# EAGLE design dennisquad (EAGLE 6.5.0)
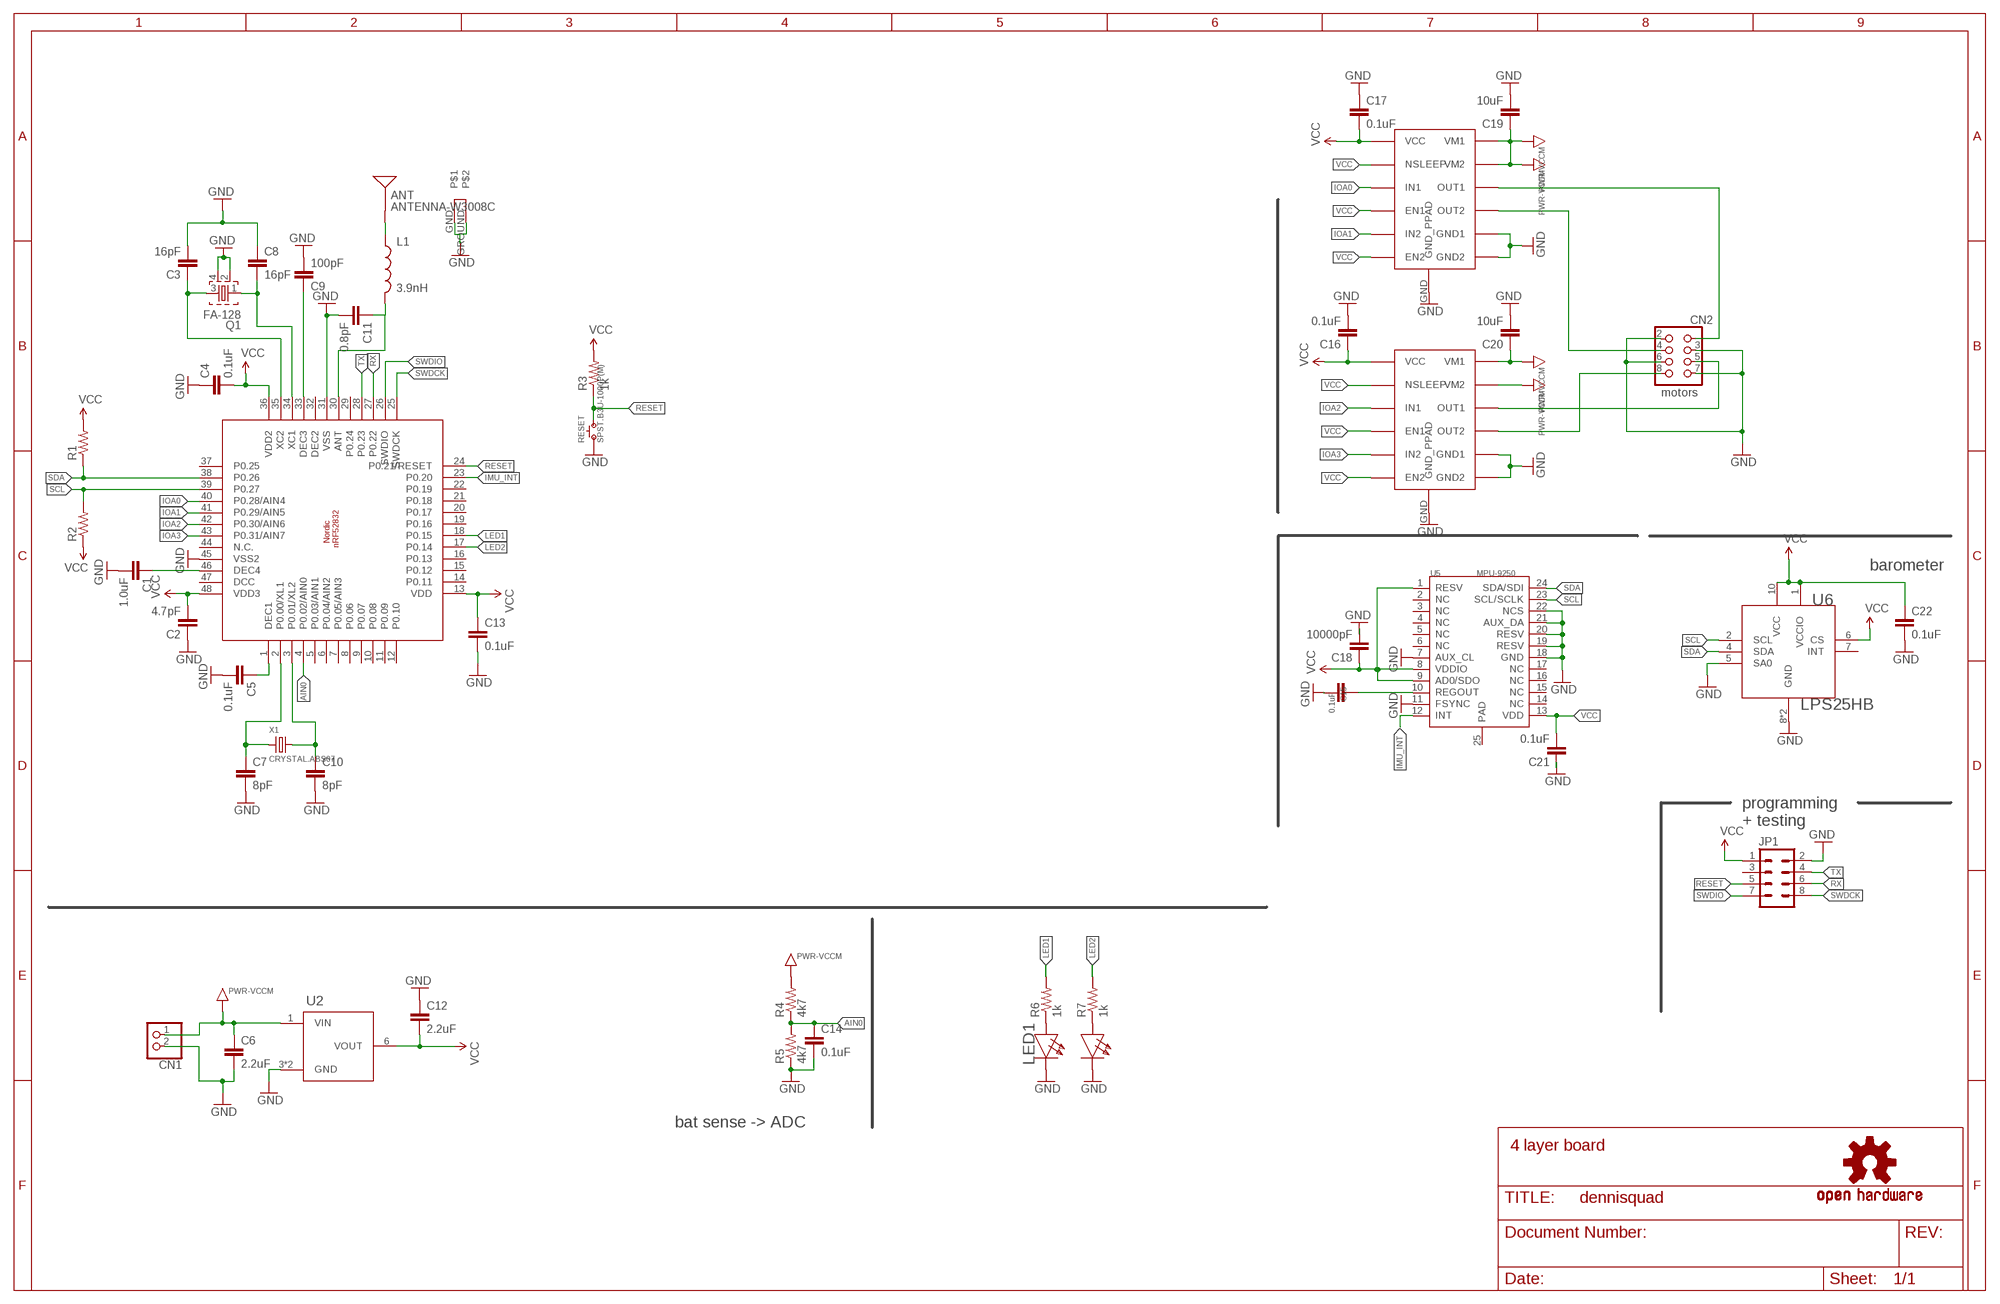
[diagram p0: schematic, sheet 1]

## Parts
ANT  ANTENNA-W3008C  [ANTENNA-W3008C]
C1  1.0uF  CAP0603-CAP  [0603-CAP]
C2  4.7pF  CAP0603-CAP  [0603-CAP]
C3  16pF  CAP0402-CAP  [0402-CAP]
C4  0.1uF  CAP0402-CAP  [0402-CAP]
C5  0.1uF  CAP0402-CAP  [0402-CAP]
C6  2.2uF  CAP0402-CAP  [0402-CAP]
C7  8pF  CAP0402-CAP  [0402-CAP]
C8  16pF  CAP0402-CAP  [0402-CAP]
C9  100pF  CAP0402-CAP  [0402-CAP]
C10  8pF  CAP0402-CAP  [0402-CAP]
C11  0.8pF  CAP0402-CAP  [0402-CAP]
C12  2.2uF  CAP0402-CAP  [0402-CAP]
C13  0.1uF  CAP0402-CAP  [0402-CAP]
C14  0.1uF  CAP0402-CAP  [0402-CAP]
C15  0.1uF  CAP0402-CAP  [0402-CAP]
C16  0.1uF  CAP0402-CAP  [0402-CAP]
C17  0.1uF  CAP0402-CAP  [0402-CAP]
C18  10000pF  CAP0402-CAP  [0402-CAP]
C19  10uF  CAP0603-CAP  [0603-CAP]
C20  10uF  CAP0603-CAP  [0603-CAP]
C21  0.1uF  CAP0402-CAP  [0402-CAP]
C22  0.1uF  CAP0402-CAP  [0402-CAP]
CN1  JST_2PIN-THM  [JST-PH-2-THM]
CN2  HEADER-2X4  [HEADER-2X04-THM]
JP1  M04X2  [2X4]
L1  3.9nH  INDUCTOR0603  [0603]
LED1  LED-DUAL0805  [SMD0805-DUAL]
LOGO1  OSHW-LOGOM  [OSHW-LOGO-M]
Q1  FA-128  [FA-128]
R1  RESISTOR0402  [0402-RES]
R2  RESISTOR0402  [0402-RES]
R3  1k  RESISTOR0402  [0402-RES]
R4  4k7  RESISTOR0402  [0402-RES]
R5  4k7  RESISTOR0402  [0402-RES]
R6  1k  RESISTOR0402  [0402-RES]
R7  1k  RESISTOR0402  [0402-RES]
RESET  SPST.B3U-1000P(M)  [B3U-1000P(M)]
U1  NRF52832_QFN48  [QFN48]
U2  MCP1700T-3302E/MAY  [6-VDFN]
U3  DRV8839  [PWSON-N12]
U4  DRV8839  [PWSON-N12]
U5  MPU-9250  [LEAD-QFN24]
U6  LPS25HB  [HLGA10L]
X1  CRYSTAL.ABS07  [ABS07]

## Nets
AIN0: C14.1 R4.1 R5.2 U1.4(P0.02/AIN0)
GND [gnd]: ANT.GND ANT.GROUND C1.2 C2.1 C3.2 C4.1 C5.2 C6.2 C7.2 C8.1 C9.2 C10.2 C11.2 C12.1 C13.2 C14.2 C15.2 C16.2 C17.1 C18.2 C19.2 C20.2 C21.1 C22.2 CN1.2 CN2.2 CN2.3 CN2.6 CN2.7 JP1.2 LED1.2(CB) LED1.3(CR) Q1.2 Q1.4 R5.1 RESET.1 U1.31(VSS) U1.45(VSS2) U2.3(GND) U2.P$1(GND) U3.GND(GND_PPAD) U3.P$5(GND1) U3.P$6(GND2) U4.GND(GND_PPAD) U4.P$5(GND1) U4.P$6(GND2) U5.7(AUX_CL) U5.11(FSYNC) U5.18(GND) U5.19(RESV) U5.20(RESV) U5.21(AUX_DA) U5.22(NCS) U6.5(SA0) U6.8(GND) U6.9(GND)
IMU_INT: U1.23(P0.20) U5.12(INT)
IOA0: U1.40(P0.28/AIN4) U3.P$9(IN1)
IOA1: U1.41(P0.29/AIN5) U3.P$11(IN2)
IOA2: U1.42(P0.30/AIN6) U4.P$9(IN1)
IOA3: U1.43(P0.31/AIN7) U4.P$11(IN2)
LED1: R6.2 U1.18(P0.15)
LED2: R7.2 U1.17(P0.14)
N$12: C15.1 U5.10(REGOUT)
N$13: C7.1 U1.2(P0.00/XL1) X1.1
N$14: LED1.1(AB) R6.1
N$15: LED1.4(AR) R7.1
N$16: CN2.1 U3.P$3(OUT1)
N$17: CN2.4 U3.P$4(OUT2)
N$18: ANT.FEED(SIGNAL) L1.1
N$19: CN2.5 U4.P$3(OUT1)
N$20: CN2.8 U4.P$4(OUT2)
N$21: C10.1 U1.3(P0.01/XL2) X1.2
N$22: C1.1 U1.46(DEC4)
N$26: C5.1 U1.1(DEC1)
N$28: C9.1 U1.33(DEC3)
N$30: C8.2 Q1.1 U1.34(XC1)
N$31: C3.1 Q1.3 U1.35(XC2)
N$32: C11.1 L1.2 U1.30(ANT)
RESET: JP1.5 R3.1 RESET.2 U1.24(P0.21/RESET)
RX: JP1.6 U1.27(P0.22)
SCL: R2.2 U1.39(P0.27) U5.23(SCL/SCLK) U6.2(SCL)
SDA: R1.1 U1.38(P0.26) U5.24(SDA/SDI) U6.4(SDA)
SWDCK: JP1.8 U1.25(SWDCK)
SWDIO: JP1.7 U1.26(SWDIO)
TX: JP1.4 U1.28(P0.23)
VCC: C2.2 C4.2 C12.2 C13.1 C16.1 C17.2 C18.1 C21.2 C22.1 JP1.1 R1.2 R2.1 R3.2 U1.13(VDD) U1.36(VDD2) U1.48(VDD3) U2.6(VOUT) U3.P$7(VCC) U3.P$8(NSLEEP) U3.P$10(EN1) U3.P$12(EN2) U4.P$7(VCC) U4.P$8(NSLEEP) U4.P$10(EN1) U4.P$12(EN2) U5.1(RESV) U5.8(VDDIO) U5.9(AD0/SDO) U5.13(VDD) U6.1(VCCIO) U6.6(CS) U6.10(VCC)
VCCM: C6.1 C19.1 C20.1 CN1.1 R4.2 U2.1(VIN) U3.P$1(VM1) U3.P$2(VM2) U4.P$1(VM1) U4.P$2(VM2) ; supply symbol labelled PWR-VCCM
Unconnected: JP1.3 U1.5(P0.03/AIN1) U1.6(P0.04/AIN2) U1.7(P0.05/AIN3) U1.8(P0.06) U1.9(P0.07) U1.10(P0.08) U1.11(P0.09) U1.12(P0.10) U1.14(P0.11) U1.15(P0.12) U1.16(P0.13) U1.19(P0.16) U1.20(P0.17) U1.21(P0.18) U1.22(P0.19) U1.29(P0.24) U1.37(P0.25) U1.44(N.C.) U5.2(NC) U5.3(NC) U5.4(NC) U5.5(NC) U5.6(NC) U5.14(NC) U5.15(NC) U5.16(NC) U5.17(NC) U5.25(PAD) U6.7(INT)

## Notes on the sheet
- motors
- barometer
- programming
  + testing
- bat sense -> ADC
- 4 layer board

## Power pins joined to a net without a drawn wire
DCC: U1.47(DCC)
DEC2: U1.32(DEC2)

## Library data of the parts
ANT = SparkFun-RF:ANTENNA-W3008C
C1 C2 = SparkFun-Capacitors:CAP: Capacitor Standard 0603 ceramic capacitor, and 0.1" leaded capacitor.
C3 C8 = SparkFun-Capacitors:CAP: Capacitor Standard 0603 ceramic capacitor, and 0.1" leaded capacitor.; MPN: GRM1555C1H160GA01D
C4 C5 C13-C17 C21 C22 = SparkFun-Capacitors:CAP: Capacitor Standard 0603 ceramic capacitor, and 0.1" leaded capacitor.; MPN: CL05B104JO5NNNC
C6 C12 = SparkFun-Capacitors:CAP: Capacitor Standard 0603 ceramic capacitor, and 0.1" leaded capacitor.; MPN: GRT155R61C225KE13D
C7 C10 = SparkFun-Capacitors:CAP: Capacitor Standard 0603 ceramic capacitor, and 0.1" leaded capacitor.; MPN: GRM1555C1H8R0BA01D
C9 = SparkFun-Capacitors:CAP: Capacitor Standard 0603 ceramic capacitor, and 0.1" leaded capacitor.; MPN: GRM1555C1H101JA01D
C11 = SparkFun-Capacitors:CAP: Capacitor Standard 0603 ceramic capacitor, and 0.1" leaded capacitor.; MPN: GRM1555C2AR80BA01D
C18 = SparkFun-Capacitors:CAP: Capacitor Standard 0603 ceramic capacitor, and 0.1" leaded capacitor.; MPN: CL05B103KP5NNNC
C19 C20 = SparkFun-Capacitors:CAP: Capacitor Standard 0603 ceramic capacitor, and 0.1" leaded capacitor.; MPN: C1206C106M4RACAUTO
CN1 = adafruit:JST_2PIN: JST 2-Pin Connectors of various flavors SMT-RA (S2B-PH-SM4) 4UConnector #17311 SMT (B2B-PH-SM4) THM-RA (S2B-PH) THM (B2B-PH)
CN2 = jaw:HEADER-2X4: PIN HEADER
JP1 = SparkFun-Connectors:M04X2: .1" header, two rows of four.
L1 = SparkFun-Passives:INDUCTOR: Inductors Basic Inductor/Choke - 0603 and 1206. Footprints are not proven and vary greatly between part numbers. INDUCTOR POWER 3.3UH 4.0A SMD 0.197" L x 0.197" W x 0.177" H (5.00mm x 5.00mm x 4.50mm); MPN: AISC-0402-3N9J-T
LED1 = jaw:LED-DUAL; MPN: APHBM2012QBDSURKC
LOGO1 = SparkFun-Aesthetics:OSHW-LOGO: Open Source Hardware Logo This logo indicates the piece of hardware it is found on incorporates a OSHW license and/or adheres to the definition of open source hardware found here: http://freedomdefined.org/OSHW
Q1 = crystal:FA-: MHz RANGE CRYSTAL UNIT Source: Epson Toyocom; MPN: FA-128 32.0000MF20X-K3
R1 R2 = SparkFun-Resistors:RESISTOR: Resistor Basic schematic elements and footprints for 0603, 1206, and PTH resistors.
R3 R6 R7 = SparkFun-Resistors:RESISTOR: Resistor Basic schematic elements and footprints for 0603, 1206, and PTH resistors.; MPN: ERJ-2GEJ102X
R4 R5 = SparkFun-Resistors:RESISTOR: Resistor Basic schematic elements and footprints for 0603, 1206, and PTH resistors.; MPN: ERJ-PA2F4701X
RESET = omron:SPST
U1 = nRF52Series:NRF52832_QFN48: Footprint and schematic part for Nordic nRF52832 of the QFN 48 pin variant. Created 6/23/15 by Jacob Dixon; FOOTPRINT: QFN48
U2 = wrea:MCP1700T-3302E/MAY; MPN: MCP1700T-3302E/MAY
U3 U4 = jseng:DRV8839
U5 = template:MPU-9250
U6 = jaw:LPS25HB
X1 = abracon:CRYSTAL; MPN: ABS07-120-32.768KHZ-T

## Net classes
2 gnd: width 0.152 mm, drill 0.254 mm, clearance 0.152 mm
5 3.3v: width 0.152 mm, drill 0.406 mm, clearance 0.152 mm

## Board
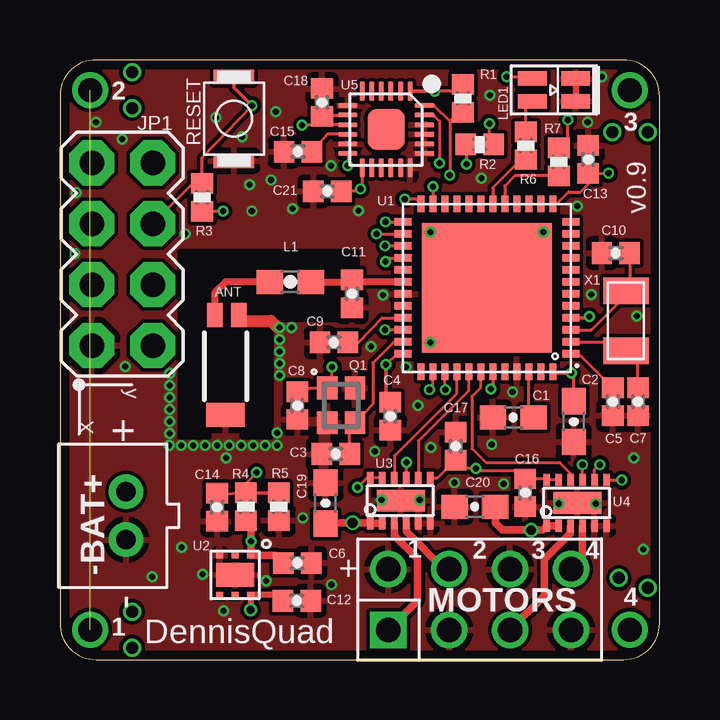
[diagram p1: board, top side]
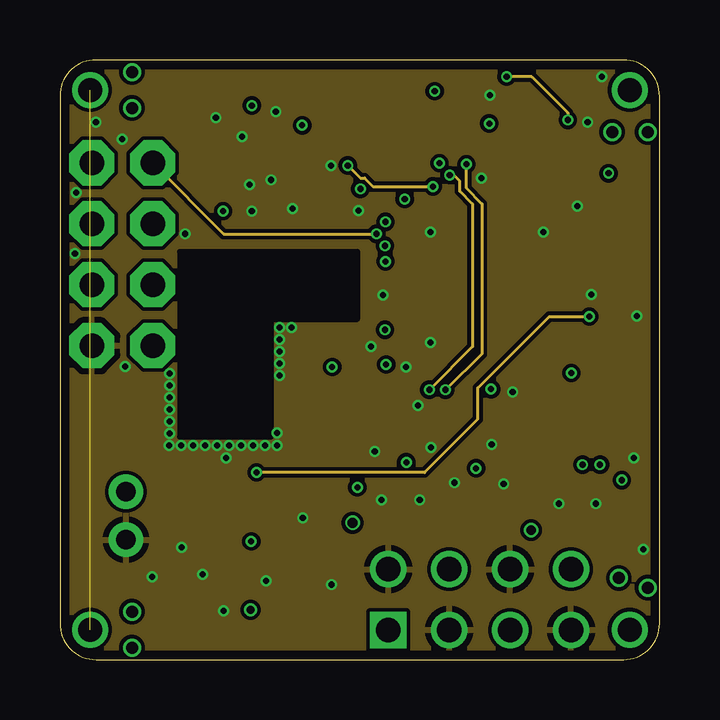
[diagram p2: board, inner layer GND]
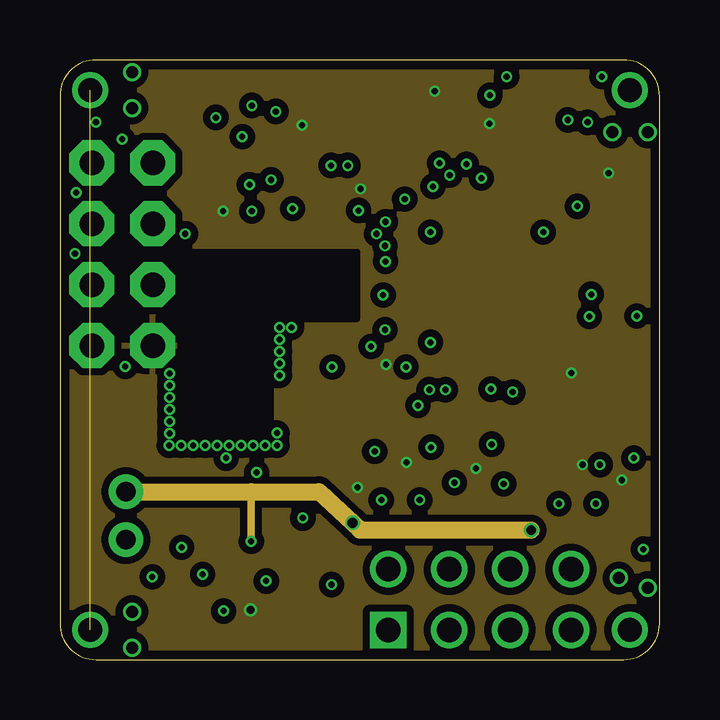
[diagram p3: board, inner layer VCC]
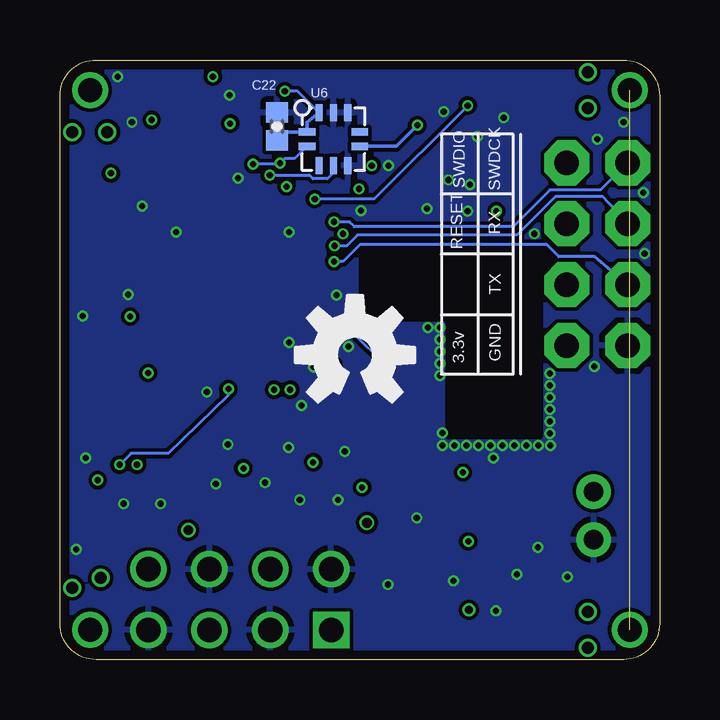
[diagram p4: board, bottom side, seen from below]

Size 25 x 25 mm. Coordinates in mm from the lower left corner, seen from the top.
Outline: 25,1.5 25,23.5 arc90 23.5,25 1.5,25 arc90 0,23.5 0,1.5 arc90 1.5,0 23.5,0 arc90 25,1.5
Copper layers (1*2*15*16): Top 0.035559375mm / dielectric 0.17018125mm / GND 0.01778125mm / dielectric 47mil / VCC 0.01778125mm / dielectric 0.17018125mm / Bottom 0.035559375mm
Design rules "OSHPark-4layer": minimum track width 5mil, minimum drill 10mil, track to track 5mil, track to pad 5mil, pad to pad 5mil, via to via 5mil, smd to smd 5mil, copper to edge 15mil, drill to drill 6mil, minimum pad ring 4mil, minimum via ring 4mil, stop-mask expansion 4mil, vias tented up to drill 0mil, thermal gap 10mil

### Footprints (pad centres in the part's own frame; a part is rotated, then mirrored left to right if it is on the bottom)
ANTENNA-W3008C = smd 0.65 x 1: FEED -0.45,2.52; GROUND 0.55,2.52 | smd 1.6 x 1: GND 0,-1.651
0603-CAP = smd 1.1 x 1: 1 -0.85,0; 2 0.85,0
0402-CAP = smd 0.85 x 0.9: 1 -0.58,0; 2 0.58,0
JST-PH-2-THM = drill 0.8 pad 1.422: 1 1,0; 2 -1,0
HEADER-2X04-THM = drill 1.016 square: 1 -3.81,-1.27 | drill 1.016: 2 -3.81,1.27; 3 -1.27,-1.27; 4 -1.27,1.27; 5 1.27,-1.27; 6 1.27,1.27; 7 3.81,-1.27; 8 3.81,1.27
2X4 = drill 1.016 pad 1.88 octagon: 1 -3.81,-1.27; 2 -3.81,1.27; 3 -1.27,-1.27; 4 -1.27,1.27; 5 1.27,-1.27; 6 1.27,1.27; 7 3.81,-1.27; 8 3.81,1.27
0603 = smd 1.1 x 1: 1 -0.85,0; 2 0.85,0
SMD0805-DUAL = smd 1.2 x 0.6: 1 -0.9,-0.475; 2 0.9,-0.475; 3 0.9,0.475; 4 -0.9,0.475
FA-128 = smd 0.95 x 0.85: 1 -0.725,-0.575; 2 0.725,-0.575; 3 0.725,0.575; 4 -0.725,0.575
0402-RES = smd 0.85 x 0.9: 1 -0.58,0; 2 0.58,0
B3U-1000P(M) = smd 0.6 x 1.7: 1 -1.75,0; 2 1.75,0
QFN48 = smd 0.3 x 0.7: 1 -2.75,-3.5; 2 -2.25,-3.5; 3 -1.75,-3.5; 4 -1.25,-3.5; 5 -0.75,-3.5; 6 -0.25,-3.5; 7 0.25,-3.5; 8 0.75,-3.5; 9 1.25,-3.5; 10 1.75,-3.5; 11 2.25,-3.5; 12 2.75,-3.5; 25 2.75,3.5; 26 2.25,3.5; 27 1.75,3.5; 28 1.25,3.5; 29 0.75,3.5; 30 0.25,3.5; 31 -0.25,3.5; 32 -0.75,3.5; 33 -1.25,3.5; 34 -1.75,3.5; 35 -2.25,3.5; 36 -2.75,3.5 | smd 0.7 x 0.3: 13 3.5,-2.75; 14 3.5,-2.25; 15 3.5,-1.75; 16 3.5,-1.25; 17 3.5,-0.75; 18 3.5,-0.25; 19 3.5,0.25; 20 3.5,0.75; 21 3.5,1.25; 22 3.5,1.75; 23 3.5,2.25; 24 3.5,2.75; 37 -3.5,2.75; 38 -3.5,2.25; 39 -3.5,1.75; 40 -3.5,1.25; 41 -3.5,0.75; 42 -3.5,0.25; 43 -3.5,-0.25; 44 -3.5,-0.75; 45 -3.5,-1.25; 46 -3.5,-1.75; 47 -3.5,-2.25; 48 -3.5,-2.75 | smd 5.4 x 5.4: 49 0,0
6-VDFN = smd 0.3 x 0.25: 1 -0.65,-0.825; 2 0,-0.825; 3 0.65,-0.825; 4 0.65,0.825; 5 0,0.825; 6 -0.65,0.825 | smd 1.6 x 1: P$1 0,0
PWSON-N12 = smd 2 x 0.9: GND 0.82,0.63 | smd 0.28 x 0.5: P$1 -0.46,-0.32; P$2 0.04,-0.32; P$3 0.54,-0.32; P$4 1.04,-0.32; P$5 1.54,-0.32; P$6 2.04,-0.32; P$7 -0.46,1.58; P$8 0.04,1.58; P$9 0.54,1.58; P$10 1.04,1.58; P$11 1.54,1.58; P$12 2.04,1.58
LEAD-QFN24 = smd 0.8 x 0.2: 1 -1.6,1; 2 -1.6,0.6; 3 -1.6,0.2; 4 -1.6,-0.2; 5 -1.6,-0.6; 6 -1.6,-1; 13 1.6,-1; 14 1.6,-0.6; 15 1.6,-0.2; 16 1.6,0.2; 17 1.6,0.6; 18 1.6,1 | smd 0.2 x 0.8: 7 -1,-1.6; 8 -0.6,-1.6; 9 -0.2,-1.6; 10 0.2,-1.6; 11 0.6,-1.6; 12 1,-1.6; 19 1,1.6; 20 0.6,1.6; 21 0.2,1.6; 22 -0.2,1.6; 23 -0.6,1.6; 24 -1,1.6 | smd 1.7 x 1.54: 25 0,0
HLGA10L = smd 0.7 x 0.3: 1 -1.1,0.3; 2 -1.1,-0.3; 6 1.1,-0.3; 7 1.1,0.3 | smd 0.3 x 0.7: 3 -0.6,-1.1; 4 0,-1.1; 5 0.6,-1.1; 8 0.6,1.1; 9 0,1.1; 10 -0.6,1.1
ABS07 = smd 1.1 x 1.9: 1 -1.25,0; 2 1.25,0

### Placement (x,y rotation side)
ANT  6.9,11.85 0 top
C1  18.9,10.1 180 top
C2  21.43,9.93 90 top
C3  11.5,8.57 180 top
C4  13.78,10.15 90 top
C5  23.05,10.75 270 top
C6  9.9,4.03 0 top
C7  24.1,10.75 270 top
C8  9.9,10.59 90 top
C9  11.43,13.22 180 top
C10  23.18,16.95 180 top
C11  12.18,15.25 270 top
C12  9.88,2.45 180 top
C13  22.02,20.85 90 top
C14  6.55,6.35 270 top
C15  9.93,21.18 180 top
C16  19.4,6.95 270 top
C17  16.5,8.9 270 top
C18  10.93,23.23 90 top
C19  11.07,6.53 90 top
C20  17.3,6.38 180 top
C21  11.15,19.52 0 top
C22  15.95,22.23 90 bottom
CN1  2.75,6 90 top
CN2  17.5,2.5 0 top
JP1  2.6,16.9 90 top
L1  9.6,15.75 0 top
LED1  20.6,23.75 0 top
LOGO1  12.7,12.7 0 bottom
Q1  11.72,10.6 270 top
R1  16.8,23.4 90 top
R2  17.5,21.48 180 top
R3  5.92,19.27 270 top
R4  7.75,6.38 270 top
R5  9.12,6.38 90 top
R6  19.43,21.43 270 top
R7  20.8,20.75 270 top
RESET  7.25,22.55 90 top
U1  17.8,15.5 90 top
U2  7.3,3.52 180 top
U3  13.4,6 0 top
U4  20.75,5.9 0 top
U5  13.6,22.1 270 top
U6  13.6,21.7 0 bottom
X1  23.6,14.12 90 top

### Tracks (layer width: path | path; a pad name or v marks a point on that pad's centre or on a via)
AIN0  (via drill 0.25)
  Top 0.127: C14.1 6.58,6.91 R4.1 7.75,7.35 v8.2,7.8
  Top 0.152: R5.2 R4.1 | U1.4 22.02,14.25 v22.07,14.3
  GND 0.127: v22.07,14.3 20.4,14.3 17.43,11.32 17.43,10.03 15.2,7.8 v8.2,7.8
GND  (via drill 0.25)
  Top 0.127: 9.07,13.85 v9.15,13.85
  Top 0.25: LED1.3 LED1.2
  Top 0.5: ANT.GROUND 7.47,14.12 8.8,14.12 9.07,13.85
  other vias: 3.85,3.45 7.9,19.8 22,22.4 22.15,15.22 18,8.97 9,22.85 7.6,21.8 11.3,20.6 21.57,18.9 6.92,8.4 24.32,4.6 23.93,8.4 14.93,10.6 13.4,6.65 15,6.65 20.8,6.5 22.35,6.5 12.97,13.05 4.58,11.43 4.58,10.93 4.58,10.43 4.58,9.93 4.58,9.43 11.32,3.12 5.08,4.67 12.45,18.73 13.47,15.2 5.05,8.93 5.55,8.93 6.05,8.93 6.55,8.93 7.05,8.93 7.55,8.93 8.05,8.93 8.55,8.93 9.05,8.93 22.6,24.3 17.57,20.07 17.93,23.52 13.12,8.68 15.47,8.85 6.5,22.6 1.5,22.4 2.6,21.7 0.62,16.93 8,18.7 8.8,20 9.7,18.8 18.88,11.15 15.45,17.82 20.15,17.82 15.45,13.22 24.05,14.32 14.43,12.2 16.45,7.38 18.5,7.33 8.6,3.27 6.83,2.02 10.12,5.9 9.15,13.35 9.15,12.85 9.65,13.85 5.22,17.75 0.68,19.48 2.73,12.22 9.05,9.45 4.55,8.93 4.58,11.93 9.15,12.35 9.15,11.85 5.95,3.55
  pour Bottom: 0,0 0,25.5 25.5,25.5 25.5,0
  pour Top: -0.05,0 -0.05,25.5 25.45,25.5 25.45,0
  pour GND (isolate 0.1): -0.05,0 -0.05,25.5 25.45,25.5 25.45,0
  cutout Top: 12.4,17 5,17 5,9.3 6.2,9.3 6.2,10.6 7.6,10.6 7.6,9.3 8.8,9.3 8.8,14.2 12.4,14.2
  cutout Bottom: 12.4,17 5,17 5,9.3 8.8,9.3 8.8,14.2 12.4,14.2
IMU_INT  (via drill 0.25)
  Top 0.127: U5.12 v12,20.6 | v15.55,19.73 U1.23
  GND 0.127: v12,20.6 12.53,20.07 12.7,20.07 13.05,19.73 v15.55,19.73
IOA0
  Top 0.127: U1.40 16.55,11.1 13.94,8.49 U3.P$9
IOA1
  Top 0.127: U1.41 17.05,11.22 14.94,9.12 U3.P$11
IOA2
  Top 0.127: U4.P$9 21.29,7.76 20.85,8.2 17.77,8.2 17.18,8.8 17.18,10.97 17.55,11.35 U1.42
IOA3  (via drill 0.25)
  Top 0.127: U4.P$11 22.29,7.92 v22.52,8.12 | U1.43 18.05,11.35 v17.98,11.28
  Bottom 0.127: v22.52,8.12 22.04,8.6 20.5,8.6 17.98,11.03 v17.98,11.28
LED1
  Top 0.127: U1.18 18.05,19.68 19.23,20.85 R6.2
LED2
  Top 0.127: R7.2 18.97,20.17 18.55,19.75 U1.17
N$1  (via drill 1)  (1 unrouted)
  other vias: 1.25,23.75 1.25,1.25
N$2  (via drill 1)
  other vias: 23.75,1.25
N$3  (via drill 1)
  other vias: 23.75,23.75
N$4  (via drill 0.5)
  other vias: 23.02,22
N$5  (via drill 0.5)
  other vias: 24.5,22
N$6  (via drill 0.5)
  other vias: 3,24.5
N$7  (via drill 0.5)
  other vias: 3,23
N$8  (via drill 0.5)
  other vias: 23.3,3.4
N$9  (via drill 0.5)
  other vias: 24.5,3
N$10  (via drill 0.5)
  other vias: 3,2
N$11  (via drill 0.5)
  other vias: 3,0.5
N$12
  Top 0.127: U5.10 11.15,21.9 C15.1
N$13
  Top 0.127: U1.2 23.02,13.25 X1.1 24.1,12.38 C7.1
N$14
  Top 0.127: R6.1 19.43,23 LED1.1
N$15  (via drill 0.25)
  Top 0.127: v18.62,24.3 19.62,24.3 LED1.4 | R7.1 21.18,21.7 v21.18,22.5
  GND 0.127: v18.62,24.3 19.68,24.3 21.18,22.8 v21.18,22.5
N$16
  Top 0.32: CN2.1 14.9,2.44 14.9,4.22 13.94,5.17 U3.P$3
N$17
  Top 0.32: U3.P$4 14.44,5.33 16,3.77 CN2.4
N$18
  Top 0.286: L1.1 6.9,15.75 6.45,15.3 ANT.FEED
N$19
  Top 0.32: U4.P$3 21.29,5.26 20.2,4.17 20.2,2.66 CN2.5
N$20
  Top 0.32: U4.P$4 21.79,4.26 CN2.8
N$21
  Top 0.127: C10.1 23.75,15.51 X1.2 23.5,15.1 22.15,13.75 U1.3
N$22
  Top 0.127: C1.1 19.55,10.3 U1.46
N$26
  Top 0.127: U1.1 21.63,12.75 C5.1
N$28
  Top 0.127: U1.33 13.43,14.25 12.46,13.22 C9.1
N$30  (via drill 0.25)
  Top 0.127: U1.34 v13.55,13.75 | v11.35,12.2 11.35,11.6 Q1.1 10.23,11.32 C8.2
  Bottom 0.127: v13.55,13.75 12.9,13.75 v11.35,12.2
N$31
  Top 0.127: U1.35 13.93,13.25 13.05,12.38 13.05,10.65 Q1.3 12.08,9.58 C3.1
N$32
  Top 0.286: U1.30 12.26,15.75 C11.1 12.1,15.75 L1.2
RESET  (via drill 0.25)
  Top 0.127: U1.24 14.85,19.2 v14.38,19.2 | v8,23.1 5.92,20.93 R3.1 5.55,19.86 JP1.5
  Top 0.152: RESET.2 7.25,23.85 v8,23.1
  Bottom 0.127: v14.38,19.2 11.9,19.2 v8,23.1
RX  (via drill 0.25)
  Top 0.127: U1.27 v13.55,17.25
  Bottom 0.127: JP1.6 2.36,19.3 4.35,19.3 5.95,17.7 12.6,17.7 13.05,17.25 v13.55,17.25
SCL  (via drill 0.25)
  Top 0.127: U5.23 15.57,22.7 15.82,22.45 v15.82,20.7 | U1.39 16.02,11.3 v16.07,11.25 | R2.2 v16.95,20.65
  GND 0.127: v16.07,11.25 17.6,12.75 17.6,19 16.95,19.65 v16.95,20.65
  Bottom 0.127: U6.2 15.2,20.9 15.62,20.9 v15.82,20.7 15.9,20.65 v16.95,20.65
SDA  (via drill 0.25)
  Top 0.127: U5.24 15.6,23.1 16.25,22.45 | v15.4,11.25 15.55,11.38 U1.38 | 16.25,22.45 v16.25,20.2 | 16.25,22.45 16.62,22.82 R1.1
  GND 0.127: v15.4,11.25 17.2,13.05 17.2,19 16.68,19.52 16.68,19.95 16.43,20.2 v16.25,20.2
  Bottom 0.127: U6.4 13.6,20.3 13.85,20.05 14.45,20.05 14.6,20.2 v16.25,20.2
SWDCK  (via drill 0.25)
  Top 0.127: v13.57,18.25 U1.25
  Bottom 0.127: JP1.8 2.46,19.57 4.58,19.57 6.1,18.05 12.72,18.05 12.93,18.25 v13.57,18.25
SWDIO  (via drill 0.25)
  Top 0.127: v13.2,17.75 U1.26
  GND 0.127: JP1.7 6.83,17.75 v13.2,17.75
TX  (via drill 0.25)
  Top 0.127: v13.57,16.6 13.72,16.75 U1.28
  Bottom 0.127: JP1.4 2.7,16.8 4.2,16.8 4.7,17.3 12.5,17.3 13.2,16.6 v13.57,16.6
VCC  (via drill 0.25, 0.33)
  Top 0.127: U4.P$8 U4.P$7 20.27,7.53 C16.1 19.02,7.88 17.45,7.88 v17.35,7.97 16.75,7.97 C17.2 15.73,7.58 U3.P$12 | U3.P$8 U3.P$7 12.8,7.58 v12.4,7.17 | U4.P$12 v23.43,7.48 | U4.P$10 v21.79,8.12 | U1.48 20.65,11.93 v21.32,11.95 21.43,11.85 C2.2 | R1.2 16.72,23.7 v15.62,23.7 | U3.P$10 v14.44,8.22 | U5.13 12.6,19.7 v12.53,19.62 12.43,19.52 C21.2 | U5.9 11.35,22.3 C18.1 | C18.1 11.01,22.7 U5.8 | C18.1 10.58,22.27 v10.1,22.27 | R3.2 v6.8,18.7 | v22.88,20.27 C13.1 22.02,19.82 21.7,19.5 21.2,19.5 20.7,19 U1.13 | R2.1 17.9,21.66 v17.9,22.35 | U1.36 14.05,12.75 v13.6,12.3
  Top 0.152: v13.6,12.3 13.6,11.03 C4.2 | U5.1 v15.62,23.7
  Top 0.25: C12.2 9.15,2.7 U2.6 v7.95,2.08
  Bottom 0.127: U6.10 15.1,23.7 v15.62,23.7
  Bottom 0.152: C22.1 15.92,22 U6.1 14.7,22.4 U6.10 | U6.6 10.97,21.4 v10.1,22.27
  cutout GND: 12.4,17 5,17 5,9.3 8.8,9.3 8.8,14.2 12.4,14.2
  pour VCC (isolate 0.3): -0.15,0 -0.15,25.5 25.45,25.5 25.45,0
  cutout VCC: 12.4,17 5,17 5,9.3 8.8,9.3 8.8,14.2 12.4,14.2
VCCM  (via drill 0.25, 0.4)
  Top 0.25: 12.88,5.71 U3.P$1
  Top 0.32: 12.88,5.71 v12.2,5.7 11.7,5.7 C19.1 | U3.P$1 U3.P$2 | C20.1 18.15,5.7 18.45,5.4 v19.65,5.4 20.14,5.4 U4.P$1 U4.P$2 | R4.2 7.97,5.47 v7.97,4.92 7.97,4.38 U2.1 8.99,4.35 C6.1
  VCC 0.32: v7.97,4.92 7.97,7
  VCC 0.7: v19.65,5.4 12.5,5.4 v12.2,5.7 10.8,7 7.97,7 CN1.1

### Text on the board
tPlace: 2 | 3 | ANT | y | X | -BAT+ | 1 | 2 | 3 | 4 | + | MOTORS | 4 | 1
bPlace: SWDCK | SWDIO | RX | RESET | TX | GND | 3.3v
tNames: v0.9 | DennisQuad